# Altium schematic sheet Digital Sensors.SchDoc
size A; SheetNumber: 3; SheetTotal: 5
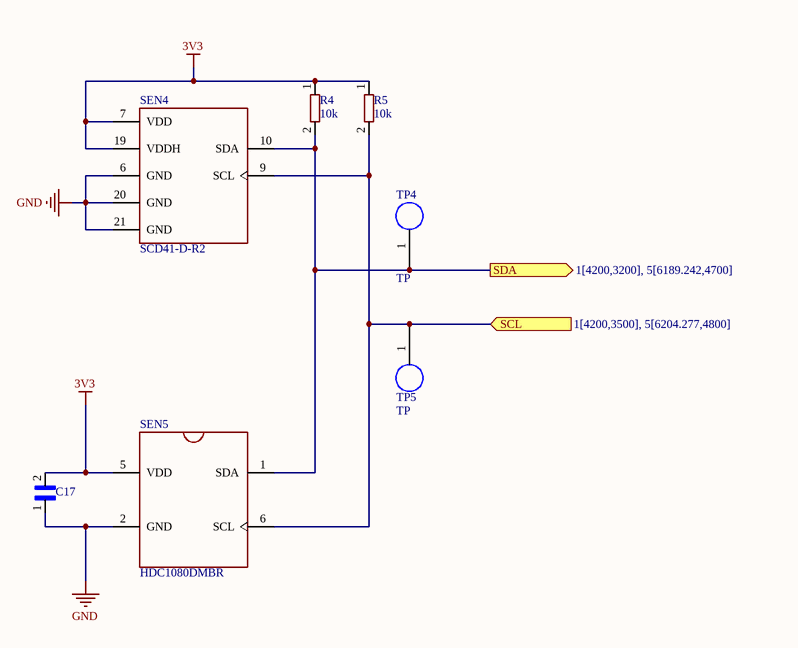
[diagram p0: Digital Sensors.SchDoc]

## Parts
C17  CC1206JRX7R9BB104  [0.1uF Capacitor]  (value not drawn)
R4  10k  [0603]
R5  10k  [0603]
SEN4  SCD41-D-R2  [XDCR_SCD41-D-R2]
SEN5  HDC1080DMBR  [SON100P300X300X80-7N]
TP4  TP  [TestPoint]  (no BOM)
TP5  TP  [TestPoint]  (no BOM)

## Ports
SCL (in, see 1[4200,3500], 5[6204.277,4800]), SDA (out, see 1[4200,3200], 5[6189.242,4700])

## Nets
3V3: C17.2 R4.1 R5.1 SEN4.7(VDD) SEN4.19(VDDH) SEN5.5(VDD)
GND: C17.1 SEN4.6(GND) SEN4.20(GND) SEN4.21(GND) SEN5.2(GND)
SCL: R5.2 SEN4.9(SCL) SEN5.6(SCL) TP5.1 ; port SCL
SDA: R4.2 SEN4.10(SDA) SEN5.1(SDA) TP4.1 ; port SDA

## Library data of the parts
C17 = CC1206JRX7R9BB104: No Description Available; Mfr_Name: Yageo
R4 R5 = RC0603FR-1310KL: http://octopart.com/rc0603fr-1310kl-yageo+%2F+phycomp-25905087; Package: None; Price: None; Value: *; MP: RC0603FR-1310KL; Availability: Unavailable
SEN4 = SCD41-D-R2: Air Quality Sensor CO2 Sensor 2.5V/3.3V/5V 20-Pin SMD EP; MF: Sensirion AG; SnapEDA_Link: https://www.snapeda.com/parts/SCD41-D-R2/Sensirion+AG/view-part/?ref=snap; Availability: In Stock; MP: SCD41-D-R2; Price: None; Purchase-URL: https://pricing.snapeda.com/search/part/SCD41-D-R2/?ref=eda; Package: None; Check_prices: https://www.snapeda.com/parts/SCD41-D-R2/Sensirion+AG/view-part/?ref=eda; Value: *
SEN5 = HDC1080DMBR: Temperature and Humidity Sensor; MF: Texas Instruments; Price: None; Availability: Unavailable; SnapEDA_Link: https://www.snapeda.com/parts/HDC1080DMBR/Texas%20Instruments/view-part/472819/?ref=snap; Value: *; MP: HDC1080DMBR; Package: WSON-6 Texas Instruments; Purchase-URL: https://pricing.snapeda.com/search/part/HDC1080DMBR/?ref=eda
TP4 TP5 = TestPoint: Test point for voltage, current, ect.